# EasyEDA Pro project class_d_amp2.eprj

# Schematic Schematic1
Board Name: Board1; Create Date: 2025-12-31; Page Name: P1; Project Name: class_d_amp2; Schematic Name: Schematic1; Update Date: 2025-12-31; Company: EasyEDA.com; Page Size: A4; Version: V1.0
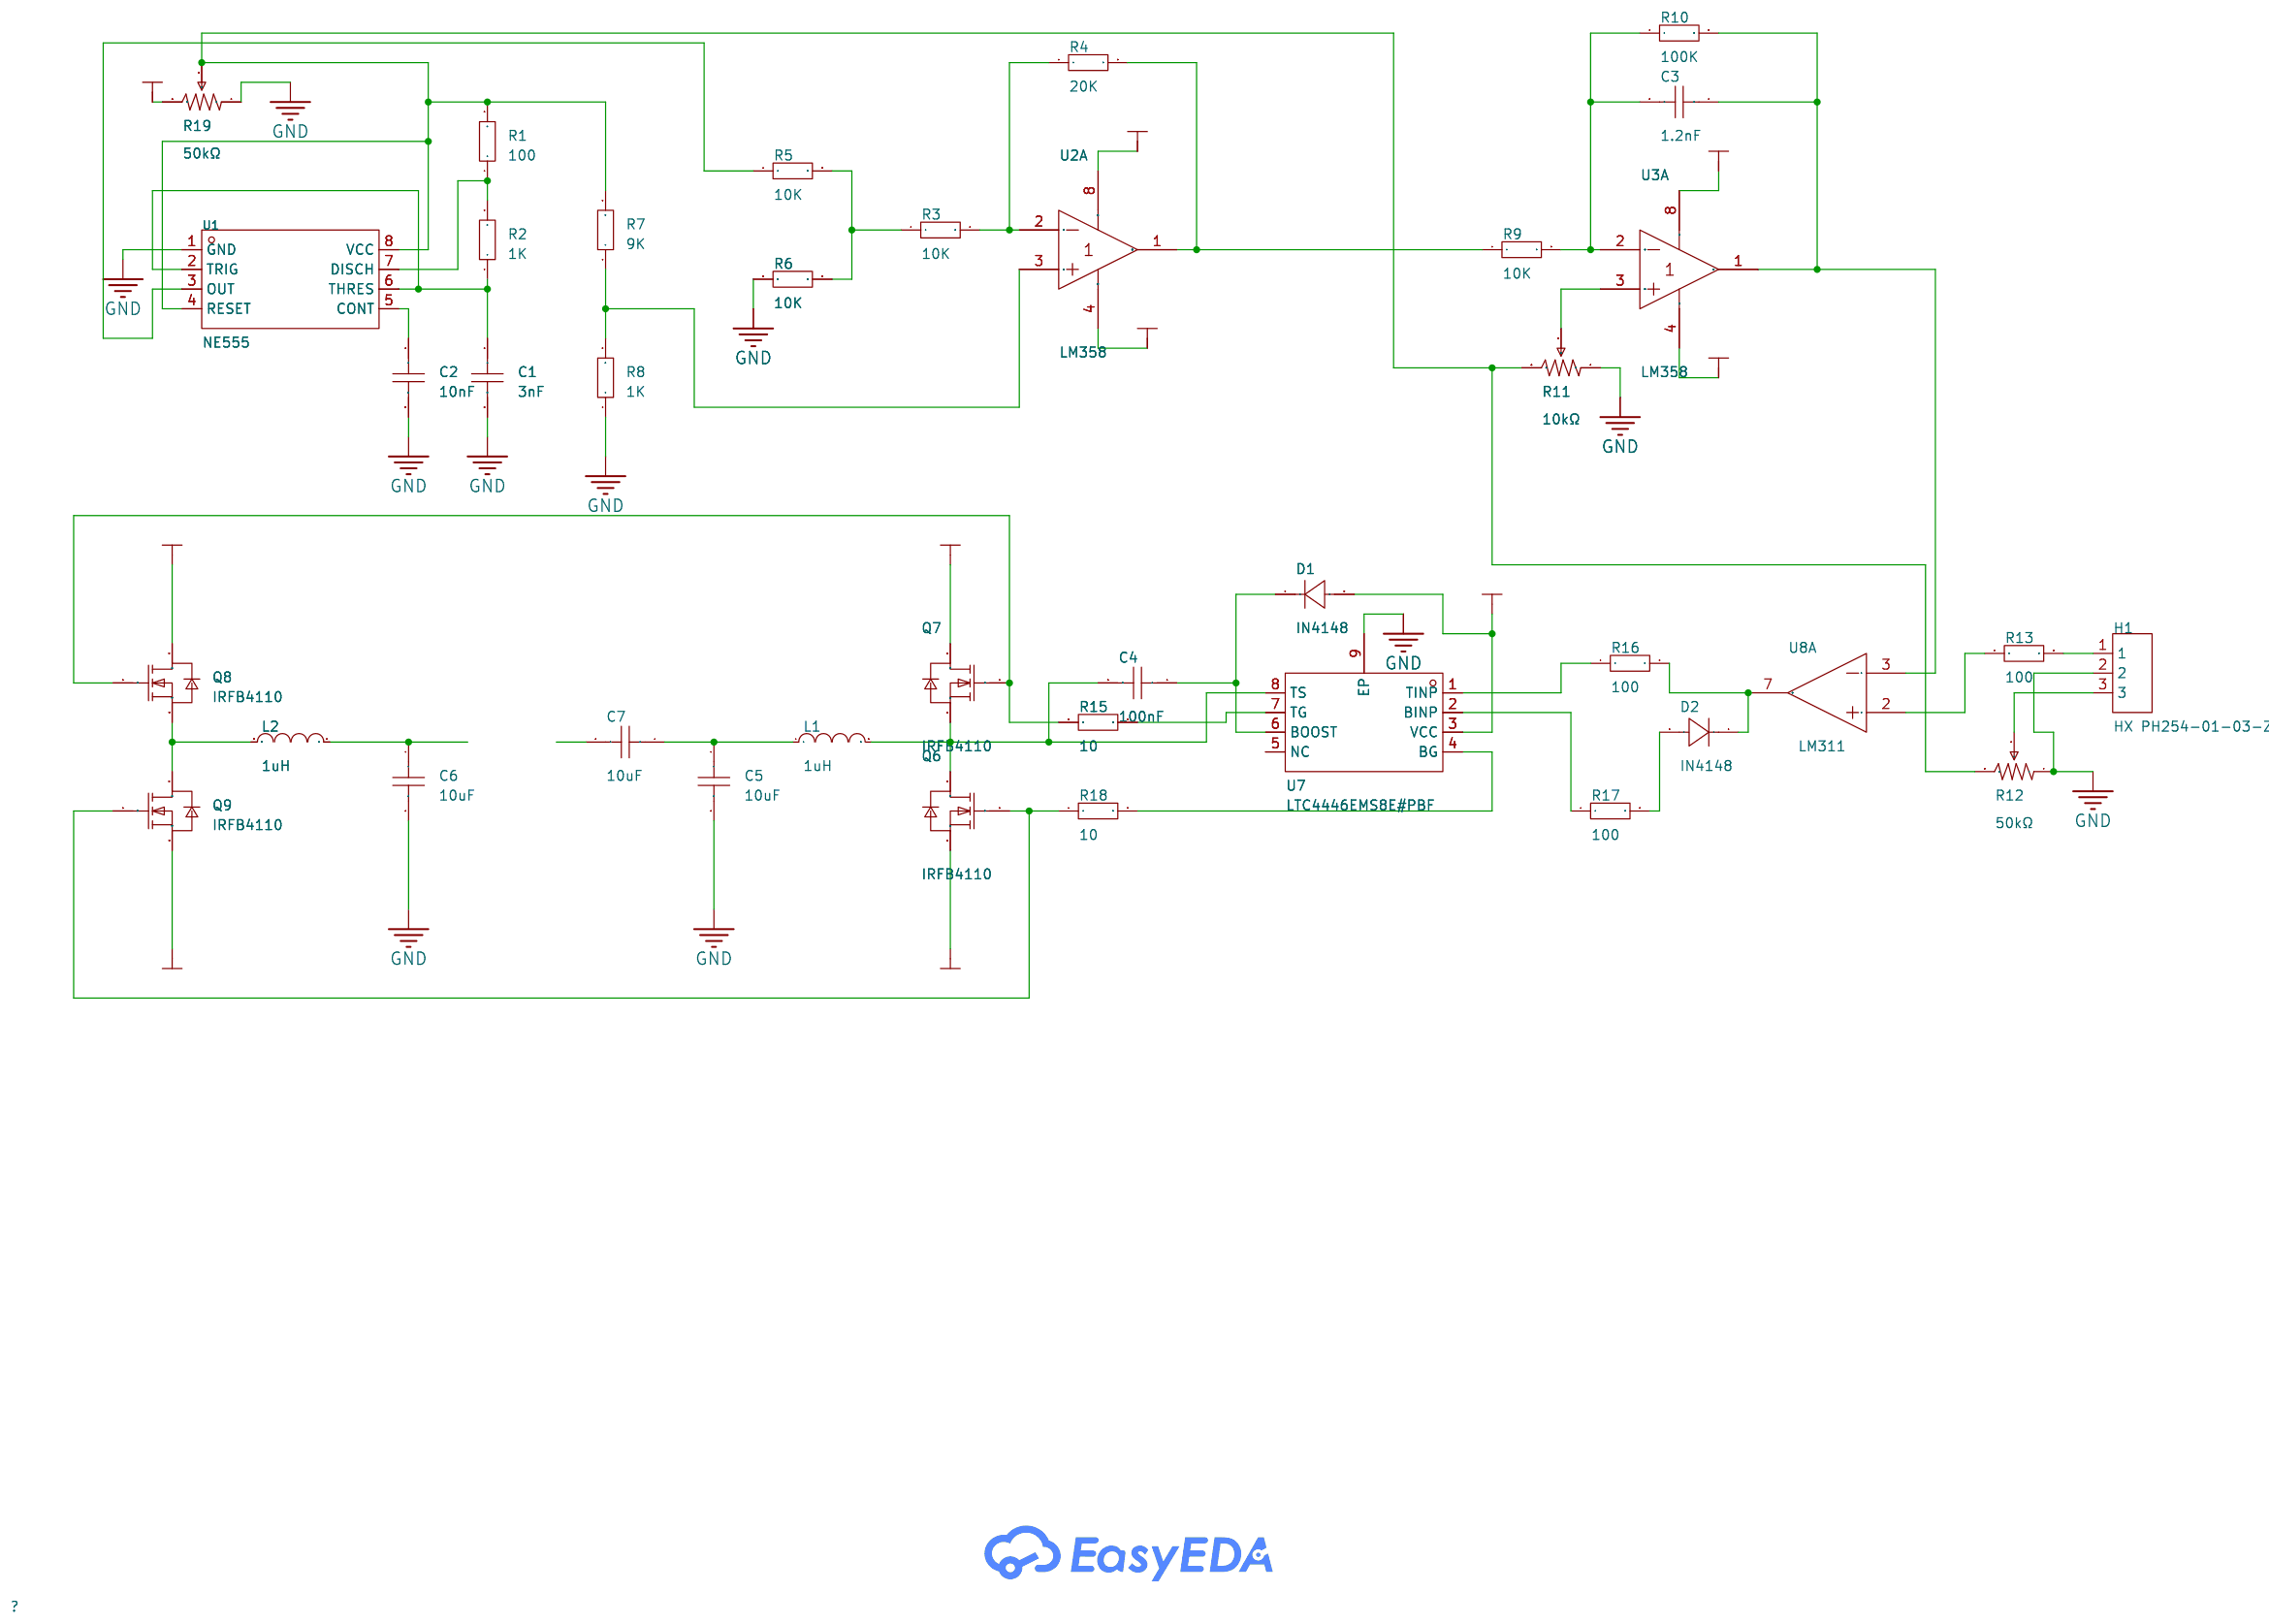
[diagram p0: schematic sheet]

## Parts
C1  3nF  [C0603]
C2  10nF  [C0603]
C3  1.2nF  [C0603]
C4  100nF  [C0603]
C5  10uF  [C0603]
C6  10uF  [C0603]
C7  10uF  [C0603]
D1  IN4148  [LL-34_L3.4-W1.5-RD]
D2  IN4148  [LL-34_L3.4-W1.5-RD]
H1  HX PH254-01-03-Z-L11.5 pcb pin header  [HDR-TH_3P-P2.54-V-M-1]
L1  1uH  [L0603]
L2  1uH  [L0603]
Q6  IRFB4110  [TO-220-3_L10.0-W4.6-P2.54-L]
Q7  IRFB4110  [TO-220-3_L10.0-W4.6-P2.54-L]
Q8  IRFB4110  [TO-220-3_L10.0-W4.6-P2.54-L]
Q9  IRFB4110  [TO-220-3_L10.0-W4.6-P2.54-L]
R1  100  [R0603]
R2  1K  [R0603]
R3  10K  [R0603]
R4  20K  [R0603]
R5  10K  [R0603]
R6  10K  [R0603]
R7  9K  [R0603]
R8  1K  [R0603]
R9  10K  [R0603]
R10  100K  [R0603]
R11  10kΩ  [RES-ADJ-TH_3296W]
R12  50kΩ  [RES-ADJ-TH_3296W]
R13  100  [R0603]
R15  10  [R0603]
R16  100  [R0603]
R17  100  [R0603]
R18  10  [R0603]
R19  50kΩ  [RES-ADJ-TH_3296W]
U1  NE555  [SOIC-8_L4.9-W3.9-P1.27-LS6.0-BL]
U2  LM358  [SOP-8_L5.0-W3.9-P1.27-LS6.0-BL]  (section 1)
U3  LM358  [SOP-8_L5.0-W3.9-P1.27-LS6.0-BL]  (section 1)
U7  LTC4446EMS8E#PBF  [MSOP-8_L3.0-W3.0-P0.65-LS5.0-BL-EP]
U8  LM311  [SOP-8_L4.9-W3.9-P1.27-LS6.0-BL]  (section 1)

## Library data of the parts
C1-C7 = CAP_0603: Supplier Footprint: 0603
D1 D2 = IN4148: Supplier Part: C9900023201; Supplier Footprint: D-1206; JLCPCB Part Class: Extended Part; Supplier: LCSC
H1 = HX PH254-01-03-Z-L11.5 pcb pin header: LCSC Part Name: 1x3P 间距:2.54mm 方针 直插; Supplier Part: C52016391; Manufacturer: hanxia(韩下); Supplier Footprint: 插件,P=2.54mm; JLCPCB Part Class: Extended Part; Datasheet: https://item.szlcsc.com/datasheet/HX%2520PH254-01-03-Z-L11.5%2520pcb%2520pin%2520header/54760436.html; Supplier: LCSC; Pin Structure: 1x3P; Pitch: 2.54mm; Circluar Pins/Square Pins: Pin Header; Mounting Type: Through Hole; Number of Rows: 1; Number of Pins: 3P; Current Rating: 3A; Voltage Rating (Max): 1kV; Length of Mating Pin: 6mm; Insulation Height: 2.5mm; Length of End Connection Pin: 3mm; Contact Material: Brass; Contact Plating: Gold; Operating Temperature: -40℃~+105℃
L1 L2 = L_0603
Q6-Q9 = IRFB4110: LCSC Part Name: 1个N沟道 耐压:100V 电流:180A; Supplier Part: C19189954; Manufacturer: minos(迈诺斯); Supplier Footprint: TO-220; JLCPCB Part Class: Extended Part; Datasheet: https://item.szlcsc.com/datasheet/IRFB4110/20422305.html; Supplier: LCSC; Number: 1 N-Channel; Drain to Source Voltage: 100V; Current - Continuous Drain(Id): 180A; RDS(on): 5mΩ@10V,50A; Pd - Power Dissipation: 211W; Gate Threshold Voltage (Vgs(th)): 3V; Gate Charge(Qg): 108nC@10V; Input Capacitance(Ciss): 6.6nF@25V; Reverse Transfer Capacitance (Crss@Vds): 210pF@25V; Operating Temperature: -55℃~+175℃
R1-R10 R13 R15-R18 = Res_0603: Supplier Footprint: 0603
R11 R12 R19 = 3296W-503: LCSC Part Name: 3296W 50KΩ±10%; Supplier Part: C48641781; Manufacturer: BAOTER(宝特); Supplier Footprint: 插件-3P,9.5x4.8mm; JLCPCB Part Class: Extended Part; Datasheet: https://item.szlcsc.com/datasheet/3296W-503/50920043.html; Supplier: LCSC; Tolerance: ±10%; Power(Watts): 500mW; Temperature Coefficient: ±250ppm/℃; Number of Turns: 28
U1 = NE555_C5125085: Supplier Part: C5125085; Manufacturer: IDCHIP(英锐芯); Supplier Footprint: SOP-8; JLCPCB Part Class: Extended Part; Datasheet: https://item.szlcsc.com/datasheet/NE555/5722226.html; Supplier: LCSC
U2 U3 = LM358_C41379067: LCSC Part Name: 运算放大器 LM358; Supplier Part: C41379067; Manufacturer: KTP(科泰普); Supplier Footprint: SOP-8; Datasheet: https://item.szlcsc.com/datasheet/LM358/43151356.html; Supplier: LCSC; Number of Channels: 2; Maximum Power Supply Range (Vdd-Vss): 36V; Vos - Input Offset Voltage: 2mV; Input Offset Voltage Drift(Vos TC): 7uV/℃; Ib - Input Bias Current: 20nA; Input Offset Current(Ios): 5nA; Common Mode Rejection Ratio(CMRR): 80dB; Quiescent Current: 500uA; Output Current: 40mA; Operating Temperature: -40℃~+85℃; Single supply: 3V~36V; Dual Supply: -18V~-1.5V；1.5V~18V
U7 = LTC4446EMS8E#PBF: LCSC Part Name: 高电压高压侧/低压侧 N 沟道 MOSFET 驱动器; Supplier Part: C688589; Manufacturer: ADI(亚德诺); Supplier Footprint: MSOP-8-EP; JLCPCB Part Class: Extended Part; Datasheet: https://item.szlcsc.com/datasheet/LTC4446EMS8E%2523PBF/719297.html; Supplier: LCSC; Driven Configuration: Half-Bridge; Load Type: MOSFET; Number of Drivers: 2; Current - Output Low(IOL): 3A; Current - Output High(IOH): 2.5A; Voltage - Supply: 7.2V~13.5V; Rise Time: 8ns; Fall Time: 5ns; Propagation Delay tpLH: 25ns; Propagation Delay tpHL: 22ns; Features: Under Voltage Protection; Operating Temperature: -40℃~+85℃; Input Logic Level - High: 2.25V~3.25V; Input Logic Level - Low: 1.85V~2.75V; Quiescent Current(Iq): 350uA
U8 = LM311: Supplier Part: C18184959; Manufacturer: Gcore(扬州国芯); Supplier Footprint: SOP-8; JLCPCB Part Class: Extended Part; Datasheet: https://item.szlcsc.com/datasheet/LM311/19328997.html; Supplier: LCSC; Number of Channels: 1; Vos - Input Offset Voltage: 2mV; Ib - Input Bias Current: 45nA; Propagation Delay Time: 200ns; Output Type: TTL；CMOS; Quiescent Current: 2.4mA; Operating Temperature: 0℃~+70℃

## Nets
+12V: D1.2(A) Q7.2(D) Q8.2(D) R19.3 U2.8(VDD) U3.8(VDD) U7.3(VCC)
-12V: Q6.3(S) Q9.3(S) U2.4(VSS) U3.4(VSS)
GND: C1.2 C2.2 C5.2 C6.2 H1.2 R6.1 R8.1 R11.1 R12.1 R19.1 U1.1(GND) U7.9(EP)
$1N468: R1.1 R2.2 U1.7(DISCH)
$1N487: C1.1 R2.1 U1.2(TRIG) U1.6(THRES)
$1N527: C2.1 U1.5(CONT)
$1N859: R3.1 R5.2 R6.2
$1N876: R3.2 R4.1 U2.2(-INA)
$1N892: R4.2 R9.1 U2.1(OUTA)
$1N1101: R5.1 U1.3(OUT)
$1N1110: R1.2 R7.2 R11.3 R12.3 R19.2 U1.4(RESET) U1.8(VCC)
$1N1263: R7.1 R8.2 U2.3(+INA)
$1N1641: C3.2 R9.2 R10.1 U3.2(-INA)
$1N1693: C3.1 R10.2 U3.1(OUTA) U8.3(IN-)
$1N1899: R11.2 U3.3(+INA)
$1N2876: R13.1 U8.2(IN+)
$1N2956: H1.3 R12.2
$1N3066: H1.1 R13.2
$1N3571: C4.2 L1.2 Q6.2(D) Q7.3(S) U7.8(TS)
$1N3578: C4.1 D1.1(K) U7.6(BOOST)
$1N3816: C5.1 C7.1 L1.1
$1N3958: R15.2 U7.7(TG)
$1N3961: Q7.1(G) Q8.1(G) R15.1
$1N4327: D2.1(K) R16.2 U8.7(OUT)
$1N4343: R16.1 U7.1(TINP)
$1N4350: D2.2(A) R17.2
$1N4356: R17.1 U7.2(BINP)
$1N4373: R18.2 U7.4(BG)
$1N4460: Q6.1(G) Q9.1(G) R18.1
$1N4827: L2.2 Q8.3(S) Q9.2(D)
$1N4833: C6.1 L2.1

Not connected (* = marked no-connect by the designer): C7 2; U7 5(NC)

# Board PCB1
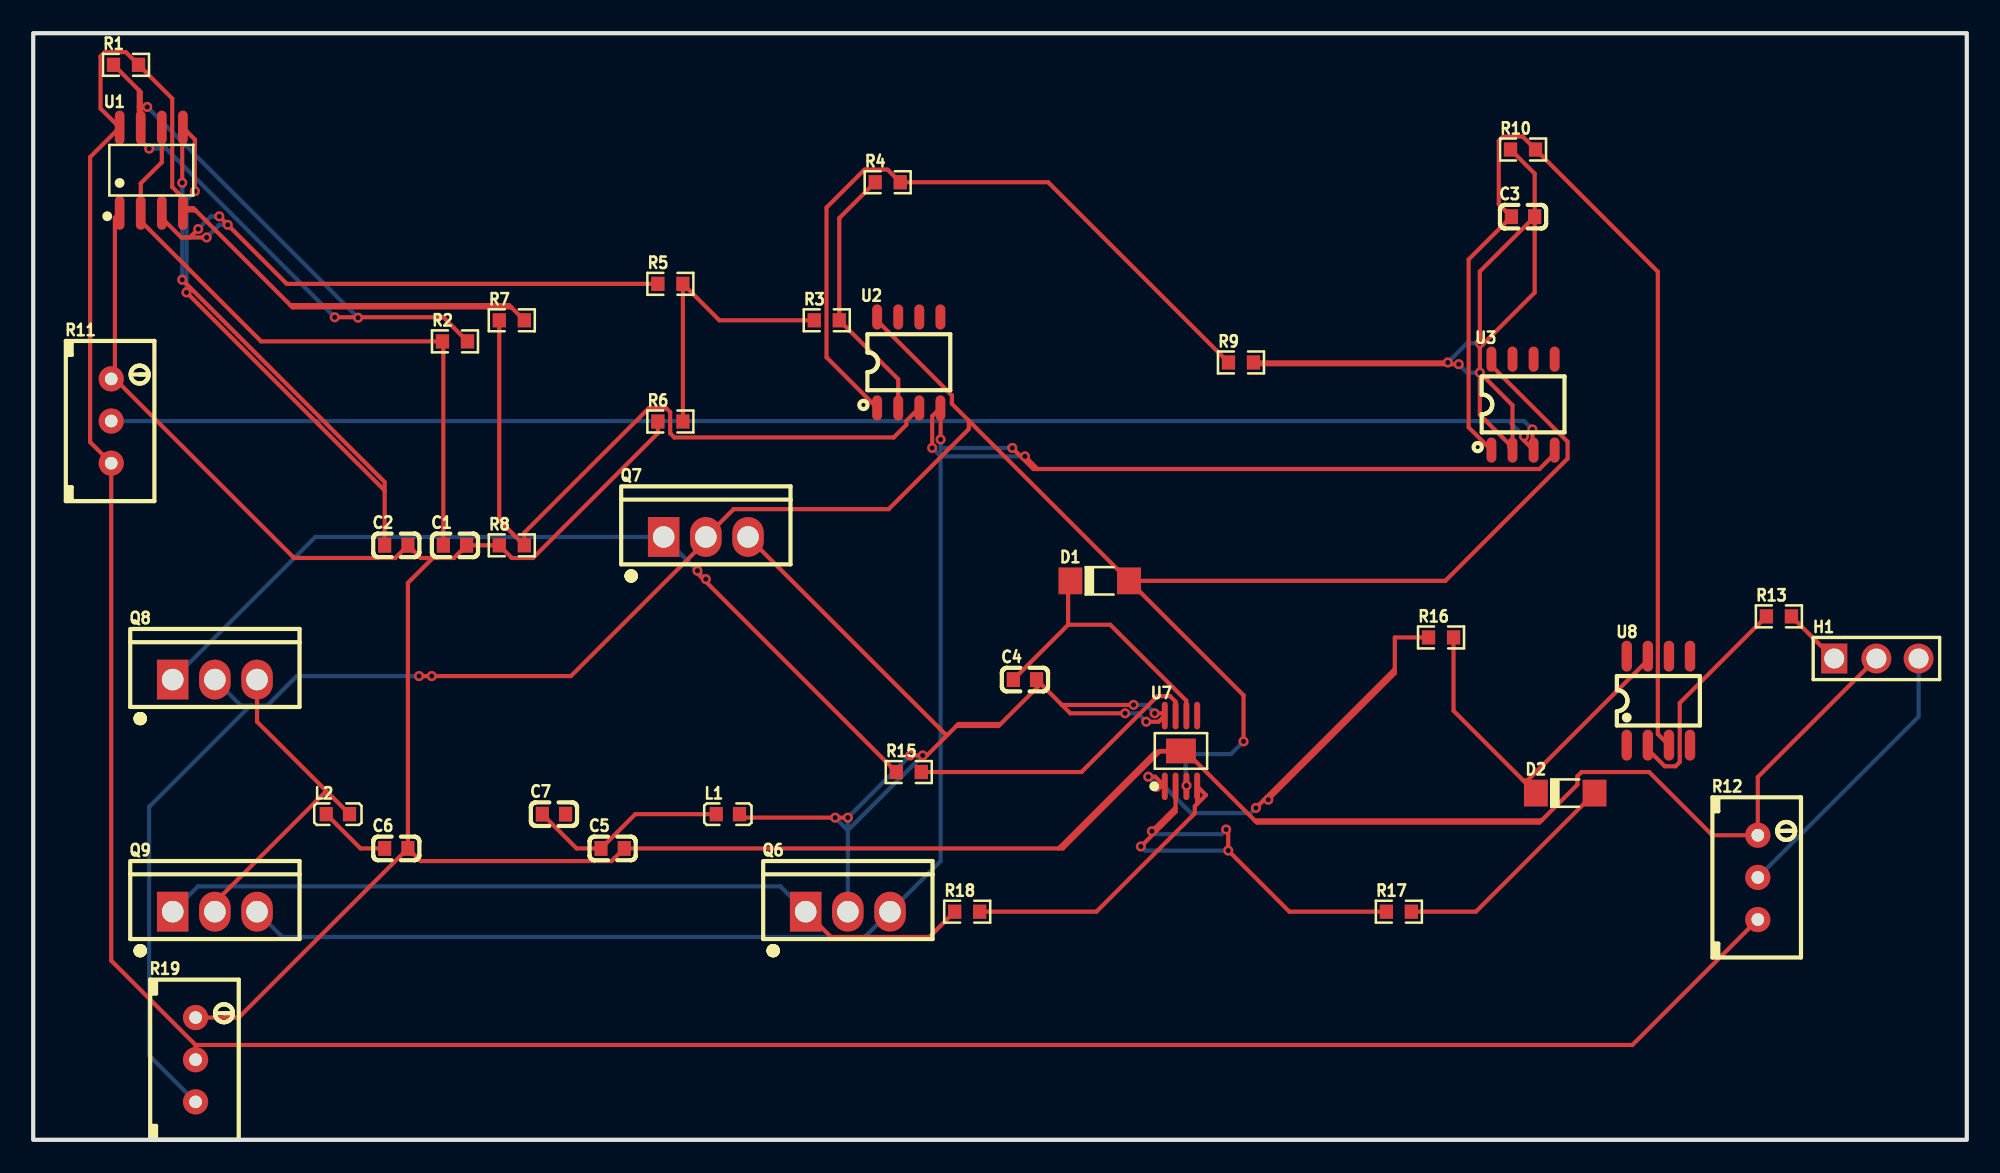
[diagram p1: board, top side]
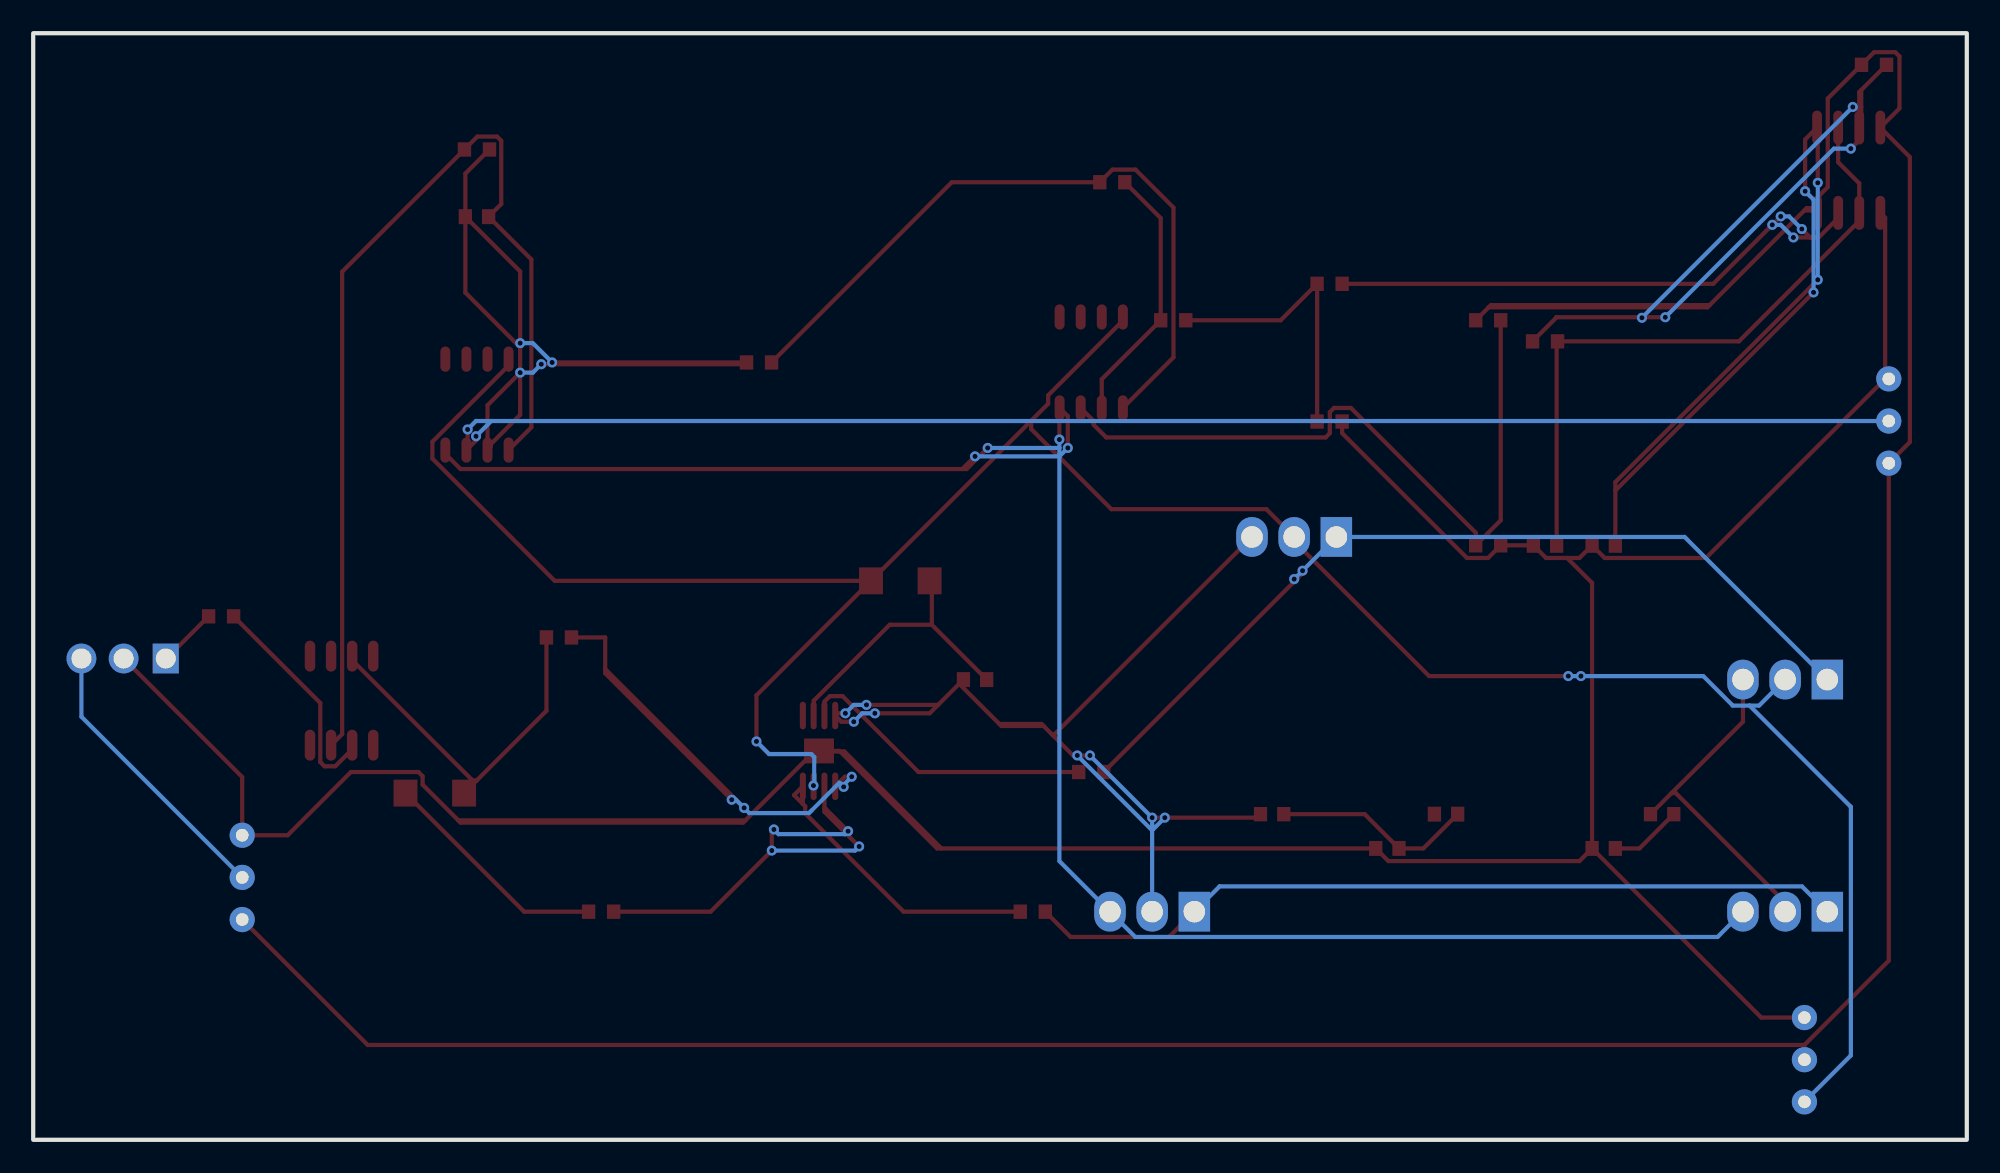
[diagram p2: board, bottom side, seen from below]

Outline 116.46 x 66.67 mm; copper layers: Top Layer, Bottom Layer. Coordinates in mm from the lower left corner of the outline.
Outline path: rectangle 0,66.67 116.46,0
Stack: Top Layer 0.035mm / Dielectric1 1.51mm FR4 er 4.5 / Bottom Layer 0.035mm

## Design rules (mm)
template: JLCPCB Capability(Two Layers Board)
spacing copperThickness1oz (default): track to track 0.102, other pairs 0.152 to 0.3
spacing copperThickness2oz: track to track 0.203, other pairs 0.152 to 0.3
track width copperThickness1oz (default): min 0.127, default 0.254, max 2.54
track width copperThickness2oz: min 0.203, default 0.254, max 2.54
differential pair differentialPair (default): width min 0.127, default 0.254, max 2.54; gap min 0.152, default 0.152
via viaSize (default): diameter min 0.5, default 0.61, max 10; hole min 0.3, default 0.305, max 6.3

## Placement (name value [footprint] x y rotation side)
C1  3nF  [C0603]  25.4 35.82 0 top
C2  10nF  [C0603]  21.87 35.82 0 top
C3  1.2nF  [C0603]  89.73 55.62 0 top
C4  100nF  [C0603]  59.73 27.73 0 top
C5  10uF  [C0603]  34.9 17.56 0 top
C6  10uF  [C0603]  21.87 17.56 0 top
C7  10uF  [C0603]  31.36 19.62 0 top
D1  IN4148  [LL-34_L3.4-W1.5-RD]  64.23 33.68 0 top
D2  IN4148  [LL-34_L3.4-W1.5-RD]  92.27 20.89 0 top
H1  HX PH254-01-03-Z-L11.5 pcb pin header  [HDR-TH_3P-P2.54-V-M-1]  111.01 29 0 top
L1  1uH  [L0603]  41.84 19.62 0 top
L2  1uH  [L0603]  18.35 19.62 0 top
Q6  IRFB4110  [TO-220-3_L10.0-W4.6-P2.54-L]  49.07 13.75 0 top
Q7  IRFB4110  [TO-220-3_L10.0-W4.6-P2.54-L]  40.51 36.32 0 top
Q8  IRFB4110  [TO-220-3_L10.0-W4.6-P2.54-L]  10.94 27.73 0 top
Q9  IRFB4110  [TO-220-3_L10.0-W4.6-P2.54-L]  10.94 13.75 0 top
R1  100  [R0603]  5.59 64.77 0 top
R2  1K  [R0603]  25.4 48.11 0 top
R3  10K  [R0603]  47.8 49.38 0 top
R4  20K  [R0603]  51.46 57.69 0 top
R5  10K  [R0603]  38.38 51.57 0 top
R6  10K  [R0603]  38.38 43.28 0 top
R7  9K  [R0603]  28.82 49.38 0 top
R8  1K  [R0603]  28.82 35.82 0 top
R9  10K  [R0603]  72.74 46.84 0 top
R10  100K  [R0603]  89.73 59.67 0 top
R11  10kΩ  [RES-ADJ-TH_3296W]  4.7 43.31 0 top
R12  50kΩ  [RES-ADJ-TH_3296W]  103.87 15.81 0 top
R13  100  [R0603]  105.14 31.54 0 top
R15  10  [R0603]  52.73 22.16 0 top
R16  100  [R0603]  84.79 30.27 0 top
R17  100  [R0603]  82.25 13.75 0 top
R18  10  [R0603]  56.25 13.75 0 top
R19  50kΩ  [RES-ADJ-TH_3296W]  9.78 4.83 0 top
U1  NE555  [SOIC-8_L4.9-W3.9-P1.27-LS6.0-BL]  7.11 58.42 0 top
U2  LM358  [SOP-8_L5.0-W3.9-P1.27-LS6.0-BL]  52.73 46.84 0 top
U3  LM358  [SOP-8_L5.0-W3.9-P1.27-LS6.0-BL]  89.73 44.3 0 top
U7  LTC4446EMS8E#PBF  [MSOP-8_L3.0-W3.0-P0.65-LS5.0-BL-EP]  69.13 23.43 0 top
U8  LM311  [SOP-8_L4.9-W3.9-P1.27-LS6.0-BL]  97.88 26.46 0 top

## Footprints (pads in the part's own frame, mm; a bottom-side part is the same pattern mirrored in y, then rotated)
C0603
  rect 0.8x0.9 smd: 1(-0.7,0) 2(0.7,0)
HDR-TH_3P-P2.54-V-M-1
  rect 1.575x1.8 hole 1.2: 1(-2.54,0)
  round 1.8 hole 1.2: 2(0,0) 3(2.54,0)
L0603
  rect 0.8x0.864 smd: 1(-0.7,0) 2(0.7,0)
LL-34_L3.4-W1.5-RD
  rect 1.44x1.62 smd: 1(-1.765,0) 2(1.765,0)
MSOP-8_L3.0-W3.0-P0.65-LS5.0-BL-EP
  oval 0.364x1.662 smd: 1(-0.975,-2.131) 2(-0.325,-2.131) 3(0.325,-2.131) 4(0.975,-2.131) 5(0.975,2.131) 6(0.325,2.131) 7(-0.325,2.131) 8(-0.975,2.131)
  rect 1.8x1.5 smd: 9(0,0)
R0603
  rect 0.806x0.864 smd: 1(-0.753,0) 2(0.753,0)
RES-ADJ-TH_3296W
  round 1.524 hole 0.762: 1(0,2.54) 2(0,0) 3(0,-2.54)
SOIC-8_L4.9-W3.9-P1.27-LS6.0-BL
  oval 0.588x2.045 smd: 1(-1.905,-2.57) 2(-0.635,-2.57) 3(0.635,-2.57) 4(1.905,-2.57) 5(1.905,2.57) 6(0.635,2.57) 7(-0.635,2.57) 8(-1.905,2.57)
SOP-8_L4.9-W3.9-P1.27-LS6.0-BL
  oval 0.63x1.865 smd: 1(-1.905,-2.683) 2(-0.635,-2.683) 3(0.635,-2.683) 4(1.905,-2.683) 5(1.905,2.683) 6(0.635,2.683) 7(-0.635,2.683) 8(-1.905,2.683)
SOP-8_L5.0-W3.9-P1.27-LS6.0-BL
  oval 0.6x1.52 smd: 1(-1.905,-2.74) 2(-0.635,-2.74) 3(0.635,-2.74) 4(1.905,-2.74) 5(1.905,2.74) 6(0.635,2.74) 7(-0.635,2.74) 8(-1.905,2.74)
TO-220-3_L10.0-W4.6-P2.54-L
  rect 1.9x2.4 hole 1.3: 1(-2.54,0)
  oval 1.9x2.4 hole 1.3: 2(0,0) 3(2.54,0)

## Nets
As in the schematic.

Pads without a net: U2 5 6 7; U3 5 6 7; U7 5; U8 1 4 5 6 8

## Via types
v1: diameter 0.61, hole 0.305, Top Layer to Bottom Layer, 44 vias

## Routing (per net, layer and track width the routed paths; a pad name or vN(x,y) marks a point on that pad's centre or on a via; arc(x,y) is an arc through that point)
+12V: length 159.6
  Top Layer w0.254: D1.2 56.35,43.33 ; D1.2 85.05,33.68 92.42,41.04 92.42,42.06 87.84,46.63 87.84,47.02 U3.8 ; D1.2 72.9,26.78 v1(72.9,24) ; 56.35,43.33 56.35,42.82 51.52,38 42.19,38 Q7.2 40.51,36.07 32.39,27.94 v1(24,27.94) v1(23.24,27.94) ; 56.35,43.33 55.33,44.35 55.33,44.85 50.83,49.36 U2.8
  Bottom Layer w0.254: v1(72.9,24) 72.14,23.24 69.6,23.24 69.42,23.06 69.42,21.39 v1(69.47,21.34) ; 13.08,26.16 6.98,20.07 6.98,5.08 R19.3 ; 13.08,26.16 12.51,26.16 Q8.2 ; 13.08,26.16 14.1,26.16 15.88,27.94 v1(23.24,27.94) v1(24,27.94)
-12V: length 118.6
  Top Layer w0.254: U3.4 91.64,41.33 90.72,40.42 60.5,40.42 ; v1(54.15,41.69) 54.15,43.6 U2.4 54.65,44.08 v1(54.65,42.19) ; v1(58.97,41.69) 60.24,40.42 60.5,40.42 ; v1(59.73,41.18) 60.5,40.42
  Bottom Layer w0.254: Q9.3 15.01,12.22 50.08,12.22 Q6.3 54.65,16.79 54.65,41.18 ; 54.65,41.18 v1(54.15,41.69) ; 54.65,41.18 54.65,41.69 ; 54.65,41.18 v1(59.73,41.18) ; 54.65,41.69 v1(58.97,41.69) ; 54.65,41.69 v1(54.65,42.19)
GND: length 217.7
  Top Layer w0.254: C6.2 22.57,33.55 24.07,35.06 ; C6.2 23.33,16.79 34.84,16.79 C5.2 61.76,17.56 ; C6.2 12.38,7.37 R19.1 ; 4.92,45.85 15.71,35.06 21.81,35.06 C2.2 23.33,35.06 24.07,35.06 ; 4.92,45.85 4.92,55.56 U1.1 ; 4.92,45.85 R11.1 ; 24.07,35.06 25.34,35.06 C1.2 R8.1 28.83,35.06 30.1,35.06 37.62,42.58 R6.1 ; 61.76,17.56 62.01,17.56 67.86,23.4 ; 61.76,17.56 67.6,23.4 67.86,23.4 ; 73.56,19.25 90.85,19.25 ; 73.56,19.25 73.7,19.11 90.72,19.11 90.85,19.25 ; 73.56,19.25 69.38,23.43 U7.9 ; 90.85,19.25 93,21.4 93,21.91 93.26,22.16 97.32,22.16 101.13,18.35 R12.1 103.87,21.86 H1.2 ; 67.86,23.4 69.1,23.4 U7.9 ; 67.86,23.4 67.89,23.43 U7.9
$1N468: length 50.7
  Top Layer w0.254: 6.48,62.23 U1.7 ; 6.48,62.23 6.48,63.13 6.36,63.25 ; 6.48,62.23 6.36,62.23 ; 6.48,62.23 v1(6.87,62.23) ; U1.7 6.48,60.23 v1(6.98,59.72) ; U1.7 6.36,61.11 6.36,62.23 ; 6.36,63.25 R1.1 ; 6.36,63.25 6.36,62.23 ; 24.7,49.56 24.73,49.56 ; 24.7,49.56 R2.2 ; 24.7,49.56 v1(18.16,49.56)
  Bottom Layer w0.254: v1(6.87,62.23) v1(19.57,49.53) ; v1(6.98,59.72) 8,59.72 v1(18.16,49.56)
$1N487: length 39.6
  Top Layer w0.254: C1.1 24.7,48.05 R2.1 13.73,48.11 6.48,55.36 U1.2 6.48,57.63 7.75,58.9 U1.6
$1N527: length 57.6
  Top Layer w0.254: 21.17,39.12 v1(9.23,51.06) ; 21.17,39.12 21.17,39.63 v1(8.98,51.82) ; 21.17,39.12 C2.1 ; v1(8.98,57.66) 8.98,60.95 U1.5 9.74,60.27 v1(9.74,57.15)
  Bottom Layer w0.254: v1(9.23,51.06) 9.23,56.65 v1(9.74,57.15) ; v1(8.98,51.82) v1(8.98,57.66)
$1N859: length 17.1
  Top Layer w0.254: R3.1 41.33,49.38 R5.2 R6.2
$1N876: length 16
  Top Layer w0.254: U2.2 52.1,45.83 R3.2 48.55,55.53 R4.1
$1N892: length 43.3
  Top Layer w0.254: U2.1 47.78,47.14 47.78,56.17 50.07,58.46 51.46,58.46 52.22,57.69 61.13,57.69 R9.1
$1N1101: length 35.5
  Top Layer w0.254: v1(10.45,54.37) 9.43,54.37 ; 9.43,54.37 v1(9.94,54.88) ; 9.43,54.37 8.92,54.37 7.75,55.54 U1.3 ; v1(11.21,55.64) v1(11.72,55.13) 15.27,51.57 R5.1
  Bottom Layer w0.254: v1(11.21,55.64) 10.7,55.64 v1(9.94,54.88) ; v1(10.45,54.37) 11.21,55.13 v1(11.72,55.13)
$1N1110: length 213
  Top Layer w0.254: R12.3 96.32,5.72 9.78,5.72 ; 9.78,5.72 4.7,10.8 R11.3 3.43,42.04 3.43,59.21 U1.8 4.06,62.14 4.06,65.28 4.31,65.53 5.58,65.53 R1.2 8.37,62.74 8.37,57.4 8.88,56.9 ; 9.78,5.72 R19.2 ; 9.02,56.13 9.64,56.13 9.78,56 ; 9.02,56.13 8.88,56.13 ; 9.02,56.13 9.02,56 ; 9.02,56.13 9.02,56.76 8.88,56.9 ; 8.88,56.13 8.88,55.99 U1.4 9.02,56 ; 8.88,56.13 8.88,56.9 ; 28.8,50.16 R7.2 ; 28.8,50.16 15.62,50.16 15.49,50.29 ; 28.8,50.16 28.66,50.29 15.49,50.29 ; 15.49,50.29 9.78,56 ; 9.78,56 9.02,56
$1N1263: length 44.2
  Top Layer w0.254: U2.3 52.59,43.32 52.59,43.08 51.83,42.32 38.62,42.32 38.37,42.57 38.37,43.84 38.11,44.1 37.09,44.1 29.58,36.58 R8.2 28.07,37.32 R7.1
$1N1641: length 63.6
  Top Layer w0.254: v1(85.2,46.84) R9.2 73.6,46.73 v1(85.86,46.73) ; R10.1 90.43,58.22 C3.2 ; v1(87.13,46.22) 89.1,44.26 U3.2 88.91,41.75 88.91,41.9 87.13,43.68 v1(87.13,46.22) ; v1(87.13,46.22) 87.13,47.75 ; 87.13,47.75 v1(87.13,48) 87.13,52.32 C3.2 ; 87.13,47.75 90.43,51.05 C3.2
  Bottom Layer w0.254: v1(87.13,46.22) 86.37,46.22 v1(85.86,46.73) ; v1(87.13,48) 86.37,48 v1(85.2,46.84)
$1N1693: length 62.4
  Top Layer w0.254: U8.3 97.85,24.44 97.85,52.3 R10.2 89.71,60.45 88.52,60.45 88.27,60.19 88.27,56.38 C3.1 86.45,53.04 86.45,42.93 U3.1
$1N1899: length 89.4
  Top Layer w0.254: 90.3,41.63 U3.3 ; 90.3,41.63 89.79,42.13 v1(89.79,42.39) ; 90.3,41.63 v1(90.3,42.8)
  Bottom Layer w0.254: 88.87,43.31 89.79,43.31 v1(90.3,42.8) ; 88.87,43.31 v1(89.79,42.39) ; 88.87,43.31 R11.2
$1N2876: length 13.6
  Top Layer w0.254: 104.39,31.54 99.17,26.32 99.17,22.76 98.91,22.51 98.26,22.51 97.25,23.52 U8.2
$1N2956: length 17.2
  Bottom Layer w0.254: H1.3 113.55,25.49 R12.2
$1N3066: length 3.6
  Top Layer w0.254: H1.1 108.44,29 R13.2
$1N3571: length 69.8
  Top Layer w0.254: L1.2 42.75,19.41 v1(48.3,19.41) v1(49.07,19.41) ; 58.26,25.05 58.15,24.94 55.61,24.94 ; 58.26,25.05 55.72,25.05 55.61,24.94 ; 58.26,25.05 60.69,27.48 ; v1(67.54,25.7) 68.02,25.7 68.15,25.56 67.78,25.19 v1(67.04,25.19) ; v1(65.77,25.7) 62.46,25.7 61.96,26.2 ; v1(52.81,23.16) 53.83,23.16 55.1,24.43 ; Q7.3 54.95,24.43 55.1,24.43 ; C4.2 60.69,27.48 ; 60.69,27.48 61.96,26.2 ; 55.61,24.94 55.1,24.43 ; 61.96,26.2 v1(66.27,26.2)
  Bottom Layer w0.254: v1(52.81,23.16) v1(49.07,19.41) 49.07,18.65 ; 49.07,18.65 v1(48.3,19.41) ; 49.07,18.65 v1(53.57,23.16) ; 49.07,18.65 Q6.2 ; v1(67.54,25.7) 67.04,26.2 v1(66.27,26.2) ; v1(65.77,25.7) 66.53,25.7 v1(67.04,25.19)
$1N3578: length 17.3
  Top Layer w0.254: D1.1 62.33,33.54 62.33,31.03 ; 62.33,31.03 64.87,31.03 69.45,26.46 69.45,25.56 ; 62.33,31.03 C4.1
$1N3816: length 12.2
  Top Layer w0.254: L1.1 36.26,19.62 C5.1 32.73,17.56 C7.1
$1N3958: length 18.2
  Top Layer w0.254: R15.2 63.14,22.16 67.71,26.73 68.47,26.73 68.8,26.4 U7.7
$1N3961: length 54
  Top Layer w0.254: v1(40.51,33.78) 40.51,33.63 ; 40.51,33.63 40,34.14 v1(40,34.29) ; 40.51,33.63 R15.1
  Bottom Layer w0.254: 8.4,27.73 17,36.32 Q7.1 v1(40,34.29) v1(40.51,33.78)
$1N4327: length 22.2
  Top Layer w0.254: 89.74,21.65 90,21.65 97.25,28.9 U8.7 ; 89.74,21.65 85.55,25.85 R16.2 ; 89.74,21.65 D2.1
$1N4343: length 37.3
  Top Layer w0.254: 82.01,28.36 82.01,28.11 v1(74.39,20.49) ; 82.01,28.36 v1(73.64,20) ; 82.01,28.36 82.01,30.27 R16.1 ; v1(67.65,21.26) 68.12,21.26 68.15,21.3 67.58,21.88 v1(67.16,21.88)
  Bottom Layer w0.254: v1(67.16,21.88) 67.66,21.38 67.76,21.38 ; 67.76,21.38 67.9,21.52 69.73,19.69 73.33,19.69 v1(73.64,20) 74.13,20.49 v1(74.39,20.49) ; 67.76,21.38 v1(67.65,21.26)
$1N4350: length 14
  Top Layer w0.254: D2.2 86.89,13.75 R17.2
$1N4356: length 28.9
  Top Layer w0.254: v1(67.38,18.59) 68.75,19.96 68.8,19.96 ; U7.2 68.8,19.96 ; 68.8,19.96 68.8,19.76 v1(66.71,17.67) ; R17.1 75.66,13.75 v1(71.97,17.43) 71.97,18.57 v1(71.85,18.7)
  Bottom Layer w0.254: v1(67.38,18.59) 67.56,18.42 71.56,18.42 v1(71.85,18.7) ; v1(71.97,17.43) 66.96,17.43 v1(66.71,17.67)
$1N4373: length 18.6
  Top Layer w0.254: R18.2 64.04,13.75 69.96,19.67 69.96,20.1 70.1,20.24 ; 70.1,20.24 U7.4 70.63,20.77 70.1,20.24
$1N4460: length 49.6
  Top Layer w0.254: R18.1 53.98,12.22 48.05,12.22 Q6.1
  Bottom Layer w0.254: 8.4,13.75 9.93,15.27 45,15.27 Q6.1
$1N4827: length 20.5
  Top Layer w0.254: L2.2 17.78,20.89 ; 17.78,20.89 17.53,20.89 10.94,14.31 Q9.2 ; 17.78,20.89 13.48,25.19 Q8.3
$1N4833: length 4.4
  Top Layer w0.254: L2.1 19.72,17.56 C6.1
